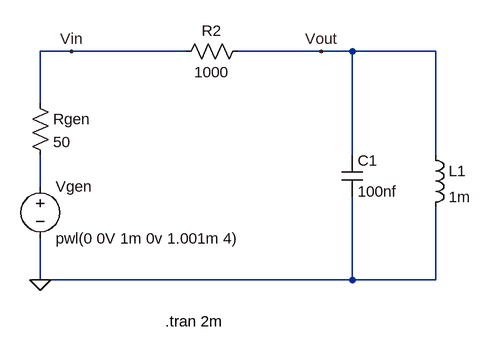
[diagram p0: schematic RLC_impulse_response.asc]
RLC_impulse_response.asc, the LTspice schematic file:
Version 4
SHEET 1 880 680
WIRE 160 -80 112 -80
WIRE 336 -80 160 -80
WIRE 544 -80 416 -80
WIRE 592 -80 544 -80
WIRE 720 -80 592 -80
WIRE 112 0 112 -80
WIRE 592 80 592 -80
WIRE 720 80 720 -80
WIRE 112 128 112 80
WIRE 112 272 112 208
WIRE 592 272 592 144
WIRE 592 272 112 272
WIRE 720 272 720 160
WIRE 720 272 592 272
FLAG 160 -80 Vin
FLAG 544 -80 Vout
FLAG 112 272 0
SYMBOL voltage 112 112 R0
SYMATTR InstName Vgen
SYMATTR Value pwl(0 0V 1m 0v 1.001m 4)
SYMBOL res 96 -16 R0
SYMATTR InstName Rgen
SYMATTR Value 50
SYMBOL res 432 -96 R90
WINDOW 0 0 56 VBottom 2
WINDOW 3 32 56 VTop 2
SYMATTR InstName R2
SYMATTR Value 1000
SYMBOL cap 576 80 R0
SYMATTR InstName C1
SYMATTR Value 100nf
SYMBOL ind 704 64 R0
SYMATTR InstName L1
SYMATTR Value 1m
TEXT 304 336 Left 2 !.tran 2m

The netlist it stands for:
* RLC_impulse_response.asc
Vgen N001 0 pwl(0 0V 1m 0v 1.001m 4)
Rgen Vin N001 50
R2 Vout Vin 1000
C1 Vout 0 100nf
L1 Vout 0 1m
.tran 2m
.backanno
.end